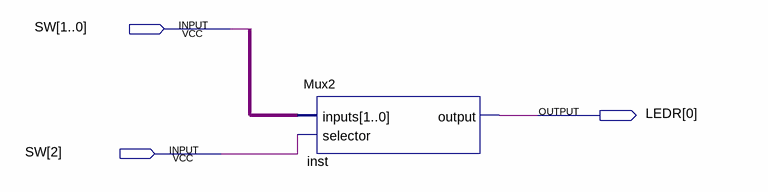
[diagram p0: schematic sheet]
// Quartus schematic Mux2_1Demo.bdf as structural Verilog: 1 symbols, 3 pins
module Mux2_1Demo (
  input  [2:0] SW,
  output [0:0] LEDR
);

  wire [1:0] undriven;

  Mux2 inst (.inputs(undriven), .selector(SW[2]), .\output (LEDR[0]));
endmodule
